# EAGLE design board (EAGLE 9.6.2)
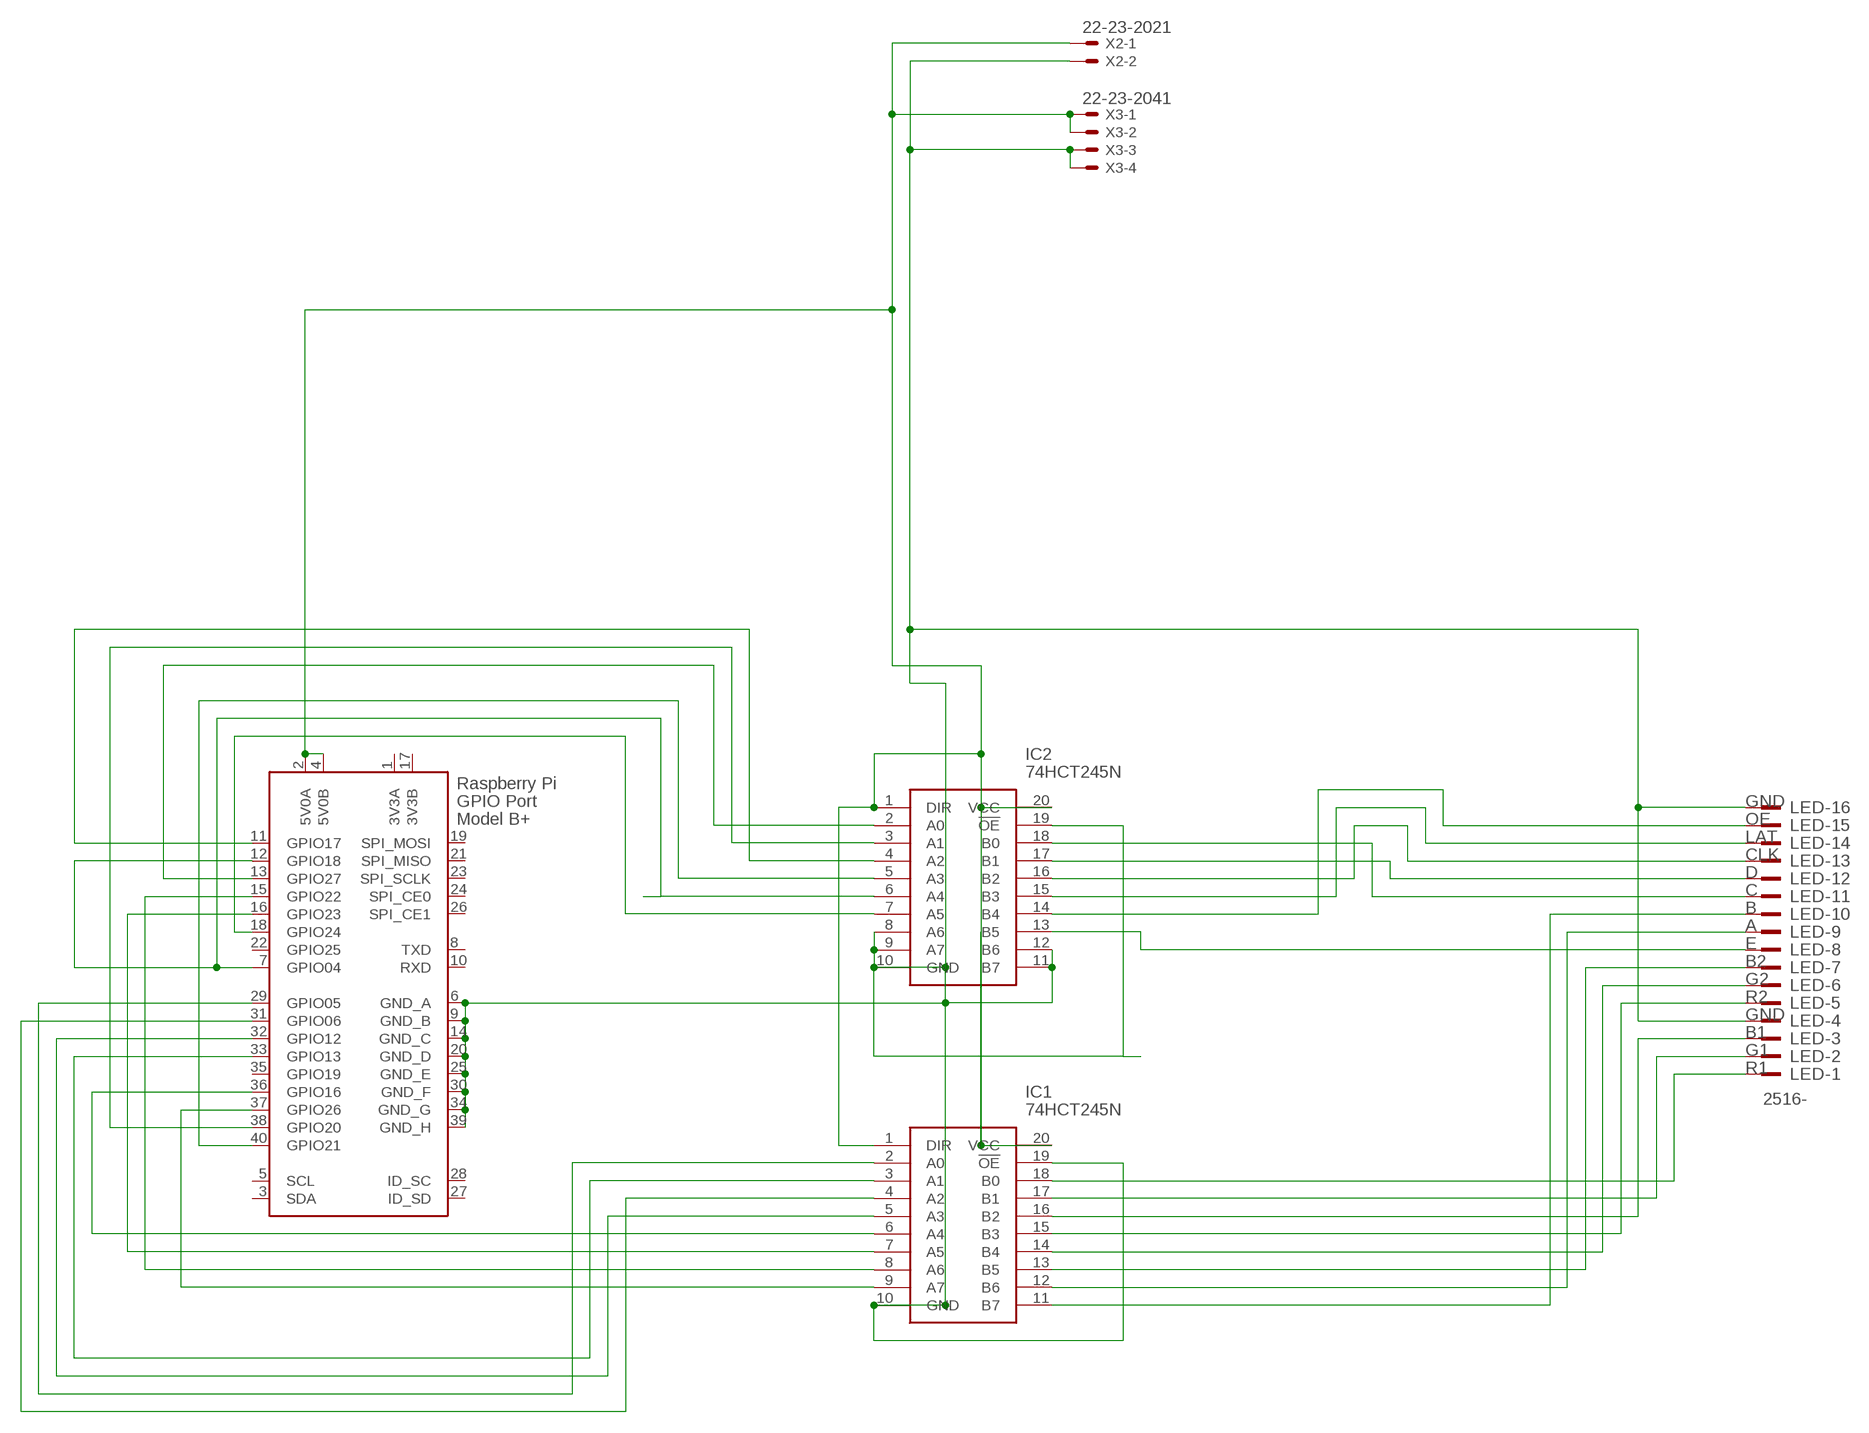
[diagram p0: schematic, sheet 1]

## Parts
IC1  74HCT245N  [DIP762W53P254L2673H420Q20N]
IC2  74HCT245N  [DIP762W53P254L2673H420Q20N]
LED  2516-  [PAK100/2500-16]
X1  RASPI_GPIO_B+#_PIN  [RASPI_GPIO_B+_PIN]
X2  22-23-2021  [22-23-2021]
X3  22-23-2041  [22-23-2041]

## Nets
+5V: IC1.1(DIR) IC1.20(VCC) IC2.1(DIR) IC2.20(VCC) X1.2(5V0A) X1.4(5V0B) X2.1 X3.1 X3.2
GND: IC1.10(GND) IC1.19(!OE) IC2.8(A6) IC2.9(A7) IC2.10(GND) IC2.11(B7) IC2.12(B6) IC2.19(!OE) LED.4 LED.16 X1.6(GND_A) X1.9(GND_B) X1.14(GND_C) X1.20(GND_D) X1.25(GND_E) X1.30(GND_F) X1.34(GND_G) X1.39(GND_H) X2.2 X3.3 X3.4
N$1: IC1.18(B0) LED.1
N$2: IC1.17(B1) LED.2
N$3: IC1.16(B2) LED.3
N$4: IC1.15(B3) LED.5
N$5: IC1.14(B4) LED.6
N$6: IC1.13(B5) LED.7
N$7: IC1.12(B6) LED.9
N$8: IC1.11(B7) LED.10
N$10: IC2.2(A0) X1.13(GPIO27)
N$11: IC2.18(B0) LED.11
N$12: IC2.17(B1) LED.12
N$13: IC2.16(B2) LED.13
N$14: IC2.15(B3) LED.14
N$15: IC2.14(B4) LED.15
N$16: IC1.9(A7) X1.37(GPIO26)
N$17: IC2.6(A4) X1.7(GPIO04) X1.12(GPIO18)
N$18: IC1.7(A5) X1.16(GPIO23)
N$19: IC1.8(A6) X1.15(GPIO22)
N$20: IC2.5(A3) X1.40(GPIO21)
N$21: IC2.3(A1) X1.38(GPIO20)
N$22: IC2.4(A2) X1.11(GPIO17)
N$23: IC1.6(A4) X1.36(GPIO16)
N$24: IC1.3(A1) X1.33(GPIO13)
N$25: IC1.5(A3) X1.32(GPIO12)
N$26: IC1.2(A0) X1.29(GPIO05)
N$27: IC1.4(A2) X1.31(GPIO06)
N$28: IC2.7(A5) X1.18(GPIO24)
N$29: IC2.13(B5) LED.8
Unconnected: X1.3(SDA) X1.5(SCL) X1.8(TXD) X1.10(RXD) X1.19(SPI_MOSI) X1.21(SPI_MISO) X1.22(GPIO25) X1.23(SPI_SCLK) X1.24(SPI_CE0) X1.26(SPI_CE1) X1.27(ID_SD) X1.28(ID_SC) X1.35(GPIO19)

## Notes on the sheet
- GND
- OE
- LAT
- CLK
- D
- C
- B
- A
- E
- B2
- G2
- R2
- GND
- B1
- G1
- R1

## Power pins joined to a net without a drawn wire
3V3A: X1.1(3V3A)
3V3B: X1.17(3V3B)

## Library data of the parts
IC1 IC2 = 74HCT245N:74HCT245N: Octal bus transceiver Source: Datasheet <http://www.farnell.com/datasheets/7596.pdf?_ga=2.65338350.1774878203.1573759110-523797770.1571638354>; DESCRIPTION: Octal bus transceiver; HEIGHT: 4.2mm; MANUFACTURER_NAME: Nexperia; MANUFACTURER_PART_NUMBER: 74HCT245N
LED = con-3m:2516-: 3M (TM) Pak 100 4-Wall Header Source: 3M; OC_FARNELL: unknown; OC_NEWARK: unknown
X1 = raspberrypi_bastelstube_v13:RASPI_GPIO_B+#: 2x20 header connector, all pins connected
X2 = con-molex:22-23-2021: .100" (2.54mm) Center Header - 2 Pin; MF: MOLEX; MPN: 22-23-2021; OC_FARNELL: 1462926; OC_NEWARK: 25C3832
X3 = con-molex:22-23-2041: .100" (2.54mm) Center Header - 4 Pin; MF: MOLEX; MPN: 22-23-2041; OC_FARNELL: 1462920; OC_NEWARK: 38C0355

## Board
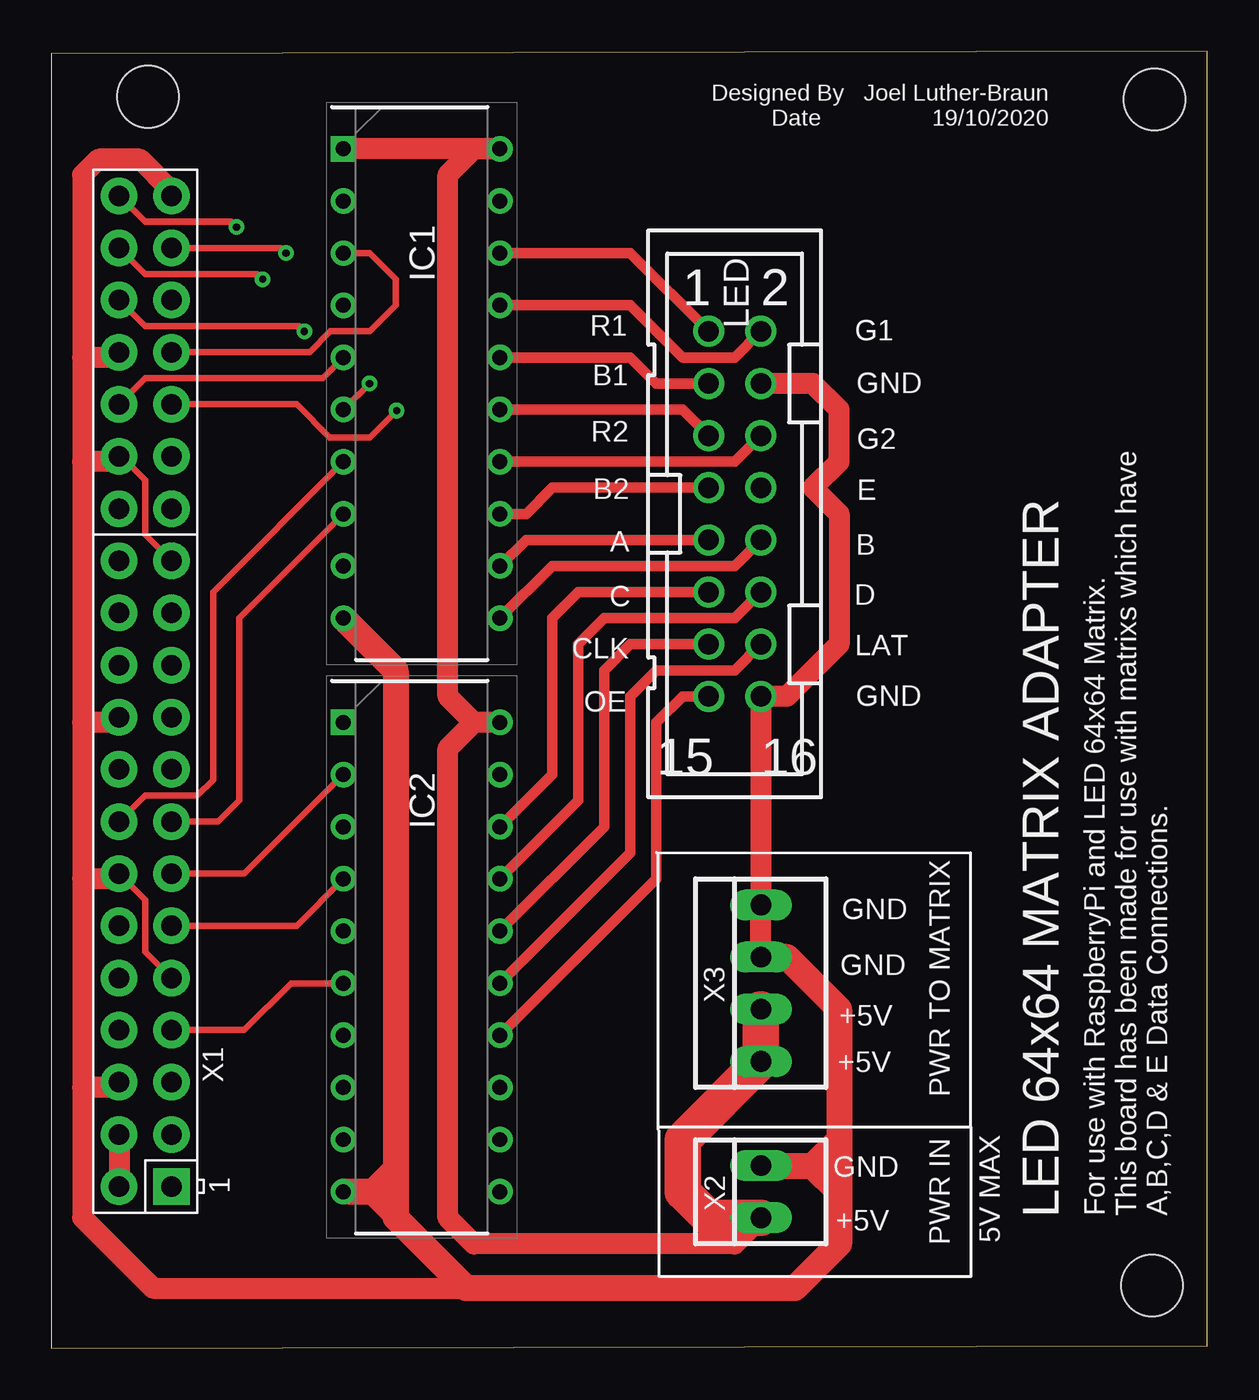
[diagram p1: board, top side]
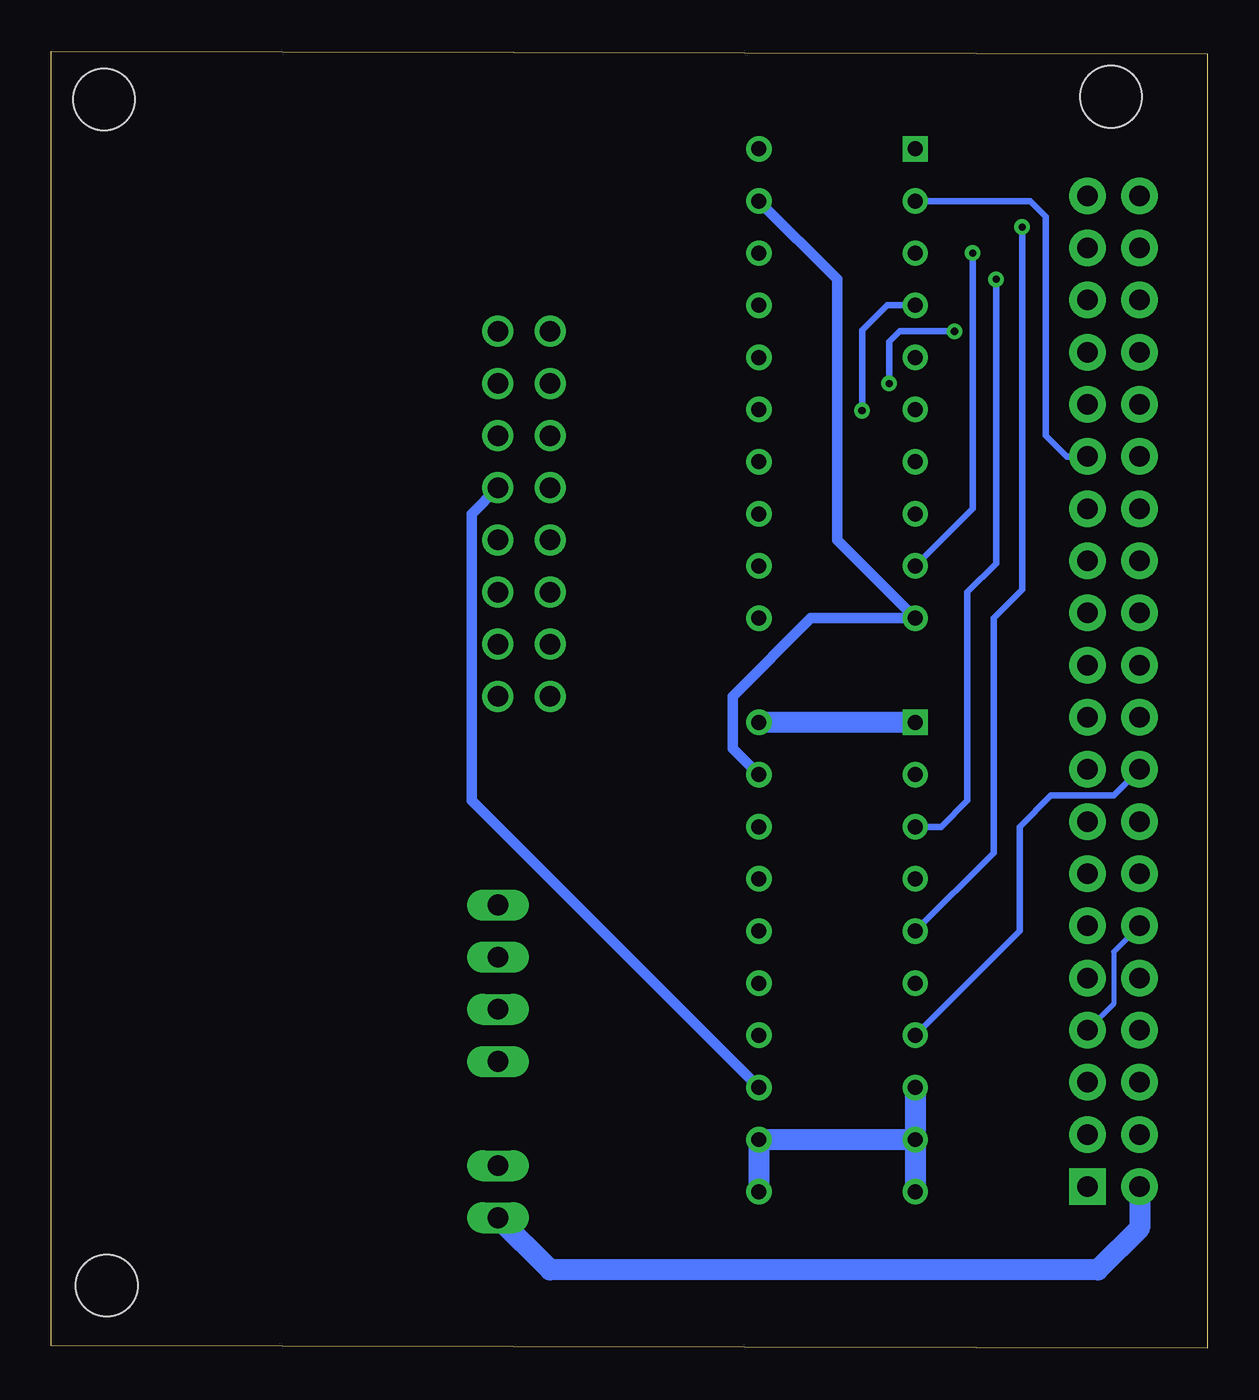
[diagram p2: board, bottom side, seen from below]

Size 56.29 x 63.17 mm. Coordinates in mm from the lower left corner, seen from the top.
Outline: 0,0 56.29,0.13 56.29,63.17 0,63.04 0,0
Copper layers (1*16): Top 0.035mm / dielectric 1.5mm / Bottom 0.035mm
Design rules "default": minimum track width 6mil, minimum drill 0.35mm, track to track 6mil, track to pad 6mil, pad to pad 6mil, via to via 6mil, smd to smd 6mil, copper to edge 40mil, drill to drill 6mil, minimum pad ring 10mil, minimum via ring 8mil, stop-mask expansion 4mil, vias tented up to drill 0mil, thermal gap 10mil
Holes 3 mm at 53.59,3.05 53.72,60.83 4.7,60.96

### Footprints (pad centres in the part's own frame; a part is rotated, then mirrored left to right if it is on the bottom)
DIP762W53P254L2673H420Q20N = drill 0.73 pad 1.13 square: 1 -3.81,11.43 | drill 0.73 pad 1.13: 2 -3.81,8.89; 3 -3.81,6.35; 4 -3.81,3.81; 5 -3.81,1.27; 6 -3.81,-1.27; 7 -3.81,-3.81; 8 -3.81,-6.35; 9 -3.81,-8.89; 10 -3.81,-11.43; 11 3.81,-11.43; 12 3.81,-8.89; 13 3.81,-6.35; 14 3.81,-3.81; 15 3.81,-1.27; 16 3.81,1.27; 17 3.81,3.81; 18 3.81,6.35; 19 3.81,8.89; 20 3.81,11.43
PAK100/2500-16 = drill 1 pad 1.422: 1 -8.89,-1.27; 2 -8.89,1.27; 3 -6.35,-1.27; 4 -6.35,1.27; 5 -3.81,-1.27; 6 -3.81,1.27; 7 -1.27,-1.27; 8 -1.27,1.27; 9 1.27,-1.27; 10 1.27,1.27; 11 3.81,-1.27; 12 3.81,1.27; 13 6.35,-1.27; 14 6.35,1.27; 15 8.89,-1.27; 16 8.89,1.27
RASPI_GPIO_B+_PIN = drill 1 pad 1.778 square: 1 -24.13,-1.27 | drill 1 pad 1.778: 2 -24.13,1.27; 3 -21.59,-1.27; 4 -21.59,1.27; 5 -19.05,-1.27; 6 -19.05,1.27; 7 -16.51,-1.27; 8 -16.51,1.27; 9 -13.97,-1.27; 10 -13.97,1.27; 11 -11.43,-1.27; 12 -11.43,1.27; 13 -8.89,-1.27; 14 -8.89,1.27; 15 -6.35,-1.27; 16 -6.35,1.27; 17 -3.81,-1.27; 18 -3.81,1.27; 19 -1.27,-1.27; 20 -1.27,1.27; 21 1.27,-1.27; 22 1.27,1.27; 23 3.81,-1.27; 24 3.81,1.27; 25 6.35,-1.27; 26 6.35,1.27; 27 8.89,-1.27; 28 8.89,1.27; 29 11.43,-1.27; 30 11.43,1.27; 31 13.97,-1.27; 32 13.97,1.27; 33 16.51,-1.27; 34 16.51,1.27; 35 19.05,-1.27; 36 19.05,1.27; 37 21.59,-1.27; 38 21.59,1.27; 39 24.13,-1.27; 40 24.13,1.27
22-23-2021 = drill 1 long: 1 -1.27,0; 2 1.27,0
22-23-2041 = drill 1 long: 1 -3.81,0; 2 -1.27,0; 3 1.27,0; 4 3.81,0

### Placement (x,y rotation side)
IC1  18.03,46.99 0 top
IC2  18.03,19.05 0 top
LED  33.27,40.64 270 top
X1  4.57,32 90 top
X2  34.54,7.62 90 top
X3  34.54,17.78 90 top

### Tracks (layer width: path | path; a pad name or v marks a point on that pad's centre or on a via)
+5V
  Top 1.016: X2.1 33.27,5.08 20.57,5.08 19.3,6.35 19.3,29.21 20.57,30.48 | IC2.20 20.57,30.48 | 20.57,30.48 19.3,31.75 19.3,57.15 20.57,58.42 IC1.20 IC1.1 | X1.4 X1.2
  Top 1.778: X3.2 X3.1 30.73,10.16 30.73,7.62 32,6.35 X2.1
  Bottom 1.016: X1.2 3.3,5.84 5.33,3.81 32,3.81 X2.1 | IC2.1 IC2.20
GND
  Top 0.305: X1.25 4.57,39.62 4.57,42.29 3.43,43.43 X1.30 | X1.9 4.57,19.3 4.57,21.84 X1.14
  Top 1.016: 16.76,8.89 15.49,7.62 16.76,6.35 | 16.76,8.89 16.76,33.02 | 19.3,3.81 16.76,6.35 | 16.76,8.89 16.76,6.35 | X3.3 X3.4 LED.16 35.81,31.75 38.35,34.29 38.35,40.64 37.08,41.91 38.35,43.18 38.35,45.72 37.08,46.99 LED.4 | X1.39 5.84,56.39 4.32,57.91 2.29,57.91 1.52,57.15 1.52,48.26 | 1.52,48.26 1.52,43.18 | 1.52,43.18 1.52,30.48 | 1.52,30.48 1.52,22.86 | 1.52,22.86 1.52,12.7 | 1.52,12.7 1.52,6.35 4.95,2.92 20.19,2.92 | X1.6 3.05,12.7 1.52,12.7 | X1.14 3.05,22.86 1.52,22.86 | X1.20 3.05,30.48 1.52,30.48 | X1.30 3.05,43.18 1.52,43.18 | X1.34 3.05,48.26 1.52,48.26
  Top 1.27: 15.49,7.62 IC2.10 | IC1.10 16.76,33.02 16.76,6.35 20.19,2.92 36.2,2.92 38.35,5.08 38.35,7.62 | X3.3 35.81,19.05 38.35,16.51 38.35,10.16 | 38.35,10.16 38.35,7.62 | X2.2 37.08,8.89 | 37.08,8.89 38.35,7.62 | 37.08,8.89 38.35,10.16
  Bottom 0.508: IC2.19 23.11,29.21 23.11,31.75 19.3,35.56 IC1.10 18.03,39.37 18.03,52.07 IC1.19
  Bottom 1.016: IC2.8 IC2.9 | IC2.9 IC2.10 | IC2.9 IC2.12 IC2.11
N$1
  Top 0.508: IC1.18 28.19,53.34 LED.1
N$2
  Top 0.508: IC1.17 28.19,50.8 30.73,48.26 33.27,48.26 LED.2
N$3
  Top 0.508: IC1.16 28.19,48.26 29.46,46.99 LED.3
N$4
  Top 0.508: IC1.15 30.73,45.72 LED.5
N$5
  Top 0.508: IC1.14 33.27,43.18 LED.6
N$6
  Top 0.508: IC1.13 23.11,40.64 24.38,41.91 LED.7
N$7
  Top 0.508: IC1.12 23.11,39.37 LED.9
N$8
  Top 0.508: IC1.11 24.38,38.1 33.27,38.1 LED.10
N$10
  Top 0.305: X1.13 9.4,23.11 IC2.2
N$11
  Top 0.508: LED.11 25.65,36.83 24.38,35.56 24.38,27.94 IC2.18
N$12
  Top 0.508: IC2.17 25.65,26.67 25.65,34.29 26.92,35.56 33.27,35.56 LED.12
N$13
  Top 0.508: LED.13 28.19,34.29 26.92,33.02 26.92,25.4 IC2.16
N$14
  Top 0.508: IC2.15 28.19,24.13 28.19,31.75 29.46,33.02 33.27,33.02 LED.14
N$15
  Top 0.508: LED.15 30.73,31.75 29.46,30.48 29.46,22.86 IC2.14
N$16  (via drill 0.35)
  Top 0.305: X1.37 11.18,53.59 v11.43,53.34
  Bottom 0.305: v11.43,53.34 11.43,40.89 IC1.9
N$17
  Top 0.305: X1.7 9.4,15.49 11.68,17.78 IC2.6
  Bottom 0.254: X1.12 4.57,19.3 4.57,16.76 X1.7
N$18
  Top 0.305: IC1.7 7.87,36.83 7.87,27.69 7.11,26.92 4.57,26.92 X1.16
N$19
  Top 0.305: IC1.8 9.14,35.56 9.14,26.67 8.13,25.65 X1.15
N$20  (via drill 0.35)
  Top 0.305: X1.40 4.57,54.86 8.76,54.86 v9.02,54.61
  Bottom 0.305: v9.02,54.61 9.02,36.96 10.41,35.56 10.41,24.13 IC2.5
N$21  (via drill 0.35)
  Top 0.305: X1.38 4.57,52.32 10.03,52.32 v10.29,52.07
  Bottom 0.305: v10.29,52.07 10.29,38.23 11.68,36.83 11.68,26.67 12.95,25.4 IC2.3
N$22
  Top 0.305: X1.11 11.94,20.57 IC2.4
N$23  (via drill 0.35)
  Top 0.305: IC1.6 v15.49,46.99 | v12.32,49.53 12.06,49.78 4.57,49.78 X1.36
  Bottom 0.305: v15.49,46.99 15.49,49.02 14.99,49.53 v12.32,49.53
N$24
  Top 0.305: X1.33 12.57,48.51 13.59,49.53 15.49,49.53 16.76,50.8 16.76,52.07 15.49,53.34 IC1.3
N$25
  Top 0.305: IC1.5 13.21,47.24 4.57,47.24 X1.32
N$26
  Bottom 0.305: X1.29 6.86,43.43 7.87,44.45 7.87,55.12 8.64,55.88 IC1.2
N$27  (via drill 0.35)
  Top 0.305: X1.31 11.94,45.97 13.56,44.35 15.49,44.35 v16.81,45.67
  Bottom 0.305: v16.81,45.67 16.81,49.58 15.6,50.8 IC1.4
N$28
  Bottom 0.305: IC2.7 9.14,20.32 9.14,25.4 7.62,26.92 4.57,26.92 X1.18
N$29
  Bottom 0.508: LED.8 35.81,40.64 35.81,26.67 IC2.13

### Text on the board
tPlace: Designed By Joel Luther-Braun / Date 19/10/2020
tNames: R1 | 1 | 2 | G1 | B1 | GND | R2 | G2 | B2 | E | A | B | C | D | CLK | LAT | OE | GND | 15 | 16 | GND | GND | +5V | +5V | PWR TO MATRIX | GND | +5V | LED 64x64 MATRIX ADAPTER | For use with RaspberryPi and LED 64x64 Matrix. / This board has been made for use with matrixs which have / A,B,C,D & E Data Connections. | 5V MAX | PWR IN